# EAGLE design ESP32 (EAGLE 9.6.2)
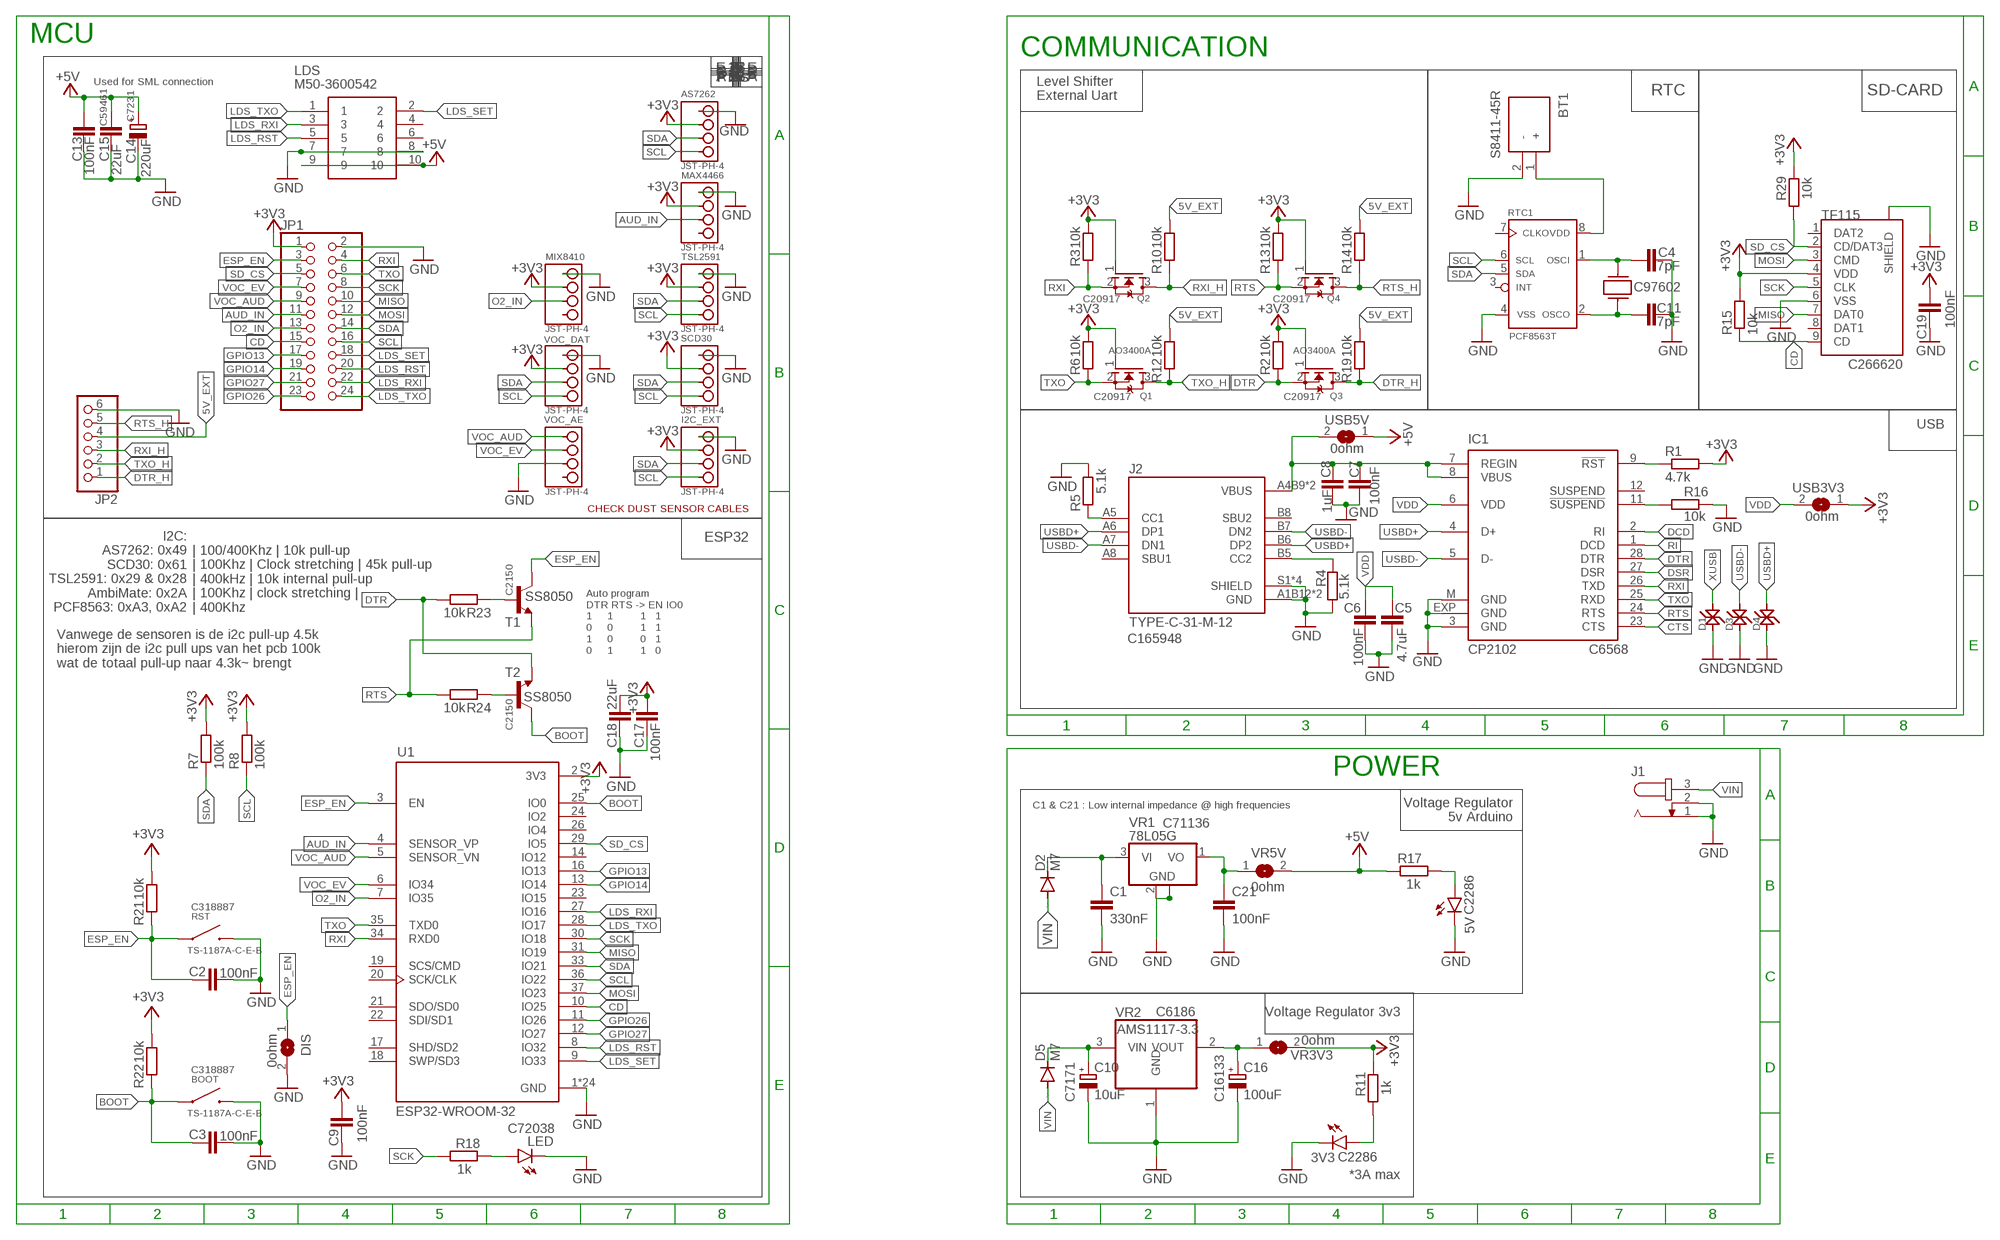
[diagram p0: schematic, sheet 1]

## Parts
3V3  C2286  LEDCHIPLED_0603  [CHIPLED_0603]
5V  C2286  LEDCHIPLED_0603  [CHIPLED_0603]
AS7262  JST-PH-4  [JST-PH-4]
BOOT  TS-1187A-C-E-B  [TS-1187A-C-E-B]
BT1  S8411-45R  [S8411-45R_1]
C1  330nF  C-EUC0805  [C0805]
C2  100nF  C-EUC0402  [C0402]
C3  100nF  C-EUC0402  [C0402]
C4  7pF  C-EUC0402  [C0402]
C5  4.7uF  C-EUC0402  [C0402]
C6  100nF  C-EUC0402  [C0402]
C7  100nF  C-EUC0402  [C0402]
C8  1uF  C-EUC0402  [C0402]
C9  100nF  C-EUC0402  [C0402]
C10  10uF  CPOL-EUA/3216-18R  [A/3216-18R]
C11  7pF  C-EUC0402  [C0402]
C13  100nF  C-EUC0402  [C0402]
C14  220uF  CPOL-EUD/7343-31R  [D/7343-31R]
C15  22uF  C-EUC0603  [C0603]
C16  100uF  CPOL-EUB/3528-21W  [B/3528-21W]
C17  100nF  C-EUC0402  [C0402]
C18  22uF  C-EUC0603  [C0603]
C19  100nF  C-EUC0402  [C0402]
C21  100nF  C-EUC0402  [C0402]
D1  LESD5D5.0CT1G  [LESD5D5.0CT1G]
D2  M7  M7DO-214AC  [DO-214AC]
D3  LESD5D5.0CT1G  [LESD5D5.0CT1G]
D4  LESD5D5.0CT1G  [LESD5D5.0CT1G]
D5  M7  M7DO-214AC  [DO-214AC]
DIS  0ohm  SJ  [SJ]
G1  32.768KHZ  [32.768KHZ]
I2C_EXT  JST-PH-4  [JST-PH-4]
IC1  CP2102  [MLP28]
J1  JACK-PLUG1  [SPC4078]
J2  TYPE-C-31-M-12  [HRO_TYPE-C-31-M-12]
JP1  PINHD-2X12  [2X12]
JP2  PINHD-1X6/90  [1X06/90]
LDS  M50-3600542  [M503600542]
LED  YELLOW  LEDCHIPLED_0603  [CHIPLED_0603]
MAX4466  JST-PH-4  [JST-PH-4]
MIX8410  JST-PH-4  [JST-PH-4]
Q1  AO3400A  MOSFET-NREFLOW  [SOT23]
Q2  AO3400A  MOSFET-NREFLOW  [SOT23]
Q3  AO3400A  MOSFET-NREFLOW  [SOT23]
Q4  AO3400A  MOSFET-NREFLOW  [SOT23]
R1  4.7k  R-EU_R0402  [R0402]
R2  10k  R-EU_R0402  [R0402]
R3  10k  R-EU_R0402  [R0402]
R4  5.1k  R-EU_R0402  [R0402]
R5  5.1k  R-EU_R0402  [R0402]
R6  10k  R-EU_R0402  [R0402]
R7  100k  R-EU_R0402  [R0402]
R8  100k  R-EU_R0402  [R0402]
R10  10k  R-EU_R0402  [R0402]
R11  1k  R-EU_R0805  [R0805]
R12  10k  R-EU_R0402  [R0402]
R13  10k  R-EU_R0402  [R0402]
R14  10k  R-EU_R0402  [R0402]
R15  10k  R-EU_R0402  [R0402]
R16  10k  R-EU_R0402  [R0402]
R17  1k  R-EU_R0805  [R0805]
R18  1k  R-EU_R0805  [R0805]
R19  10k  R-EU_R0402  [R0402]
R21  10k  R-EU_R0402  [R0402]
R22  10k  R-EU_R0402  [R0402]
R23  10k  R-EU_R0402  [R0402]
R24  10k  R-EU_R0402  [R0402]
R29  10k  R-EU_R0402  [R0402]
RST  TS-1187A-C-E-B  [TS-1187A-C-E-B]
RTC1  PCF8563T  [SOIC8]
SCD30  JST-PH-4  [JST-PH-4]
T1  SS8050  BC808-NPN-SOT23-BEC  [SOT23-BEC]
T2  SS8050  BC808-NPN-SOT23-BEC  [SOT23-BEC]
TF115  TF-115  [TF-115]
TSL2591  JST-PH-4  [JST-PH-4]
U1  ESP32-WROOM-32  [MODULE_ESP32-WROOM-32]
USB3V3  0ohm  SJ  [SJ]
USB5V  0ohm  SJ  [SJ]
VOC_AE  JST-PH-4  [JST-PH-4]
VOC_DAT  JST-PH-4  [JST-PH-4]
VR1  78L05G  78L05F  [SOT89]
VR2  AMS1117-3.3  REG1117  [SOT223]
VR3V3  0ohm  SJ  [SJ]
VR5V  0ohm  SJ  [SJ]

## Nets
5V_EXT: JP2.4 R10.1 R12.1 R14.1 R19.1
+3V3: AS7262.P2 C9.2 C17.2 C18.2 C19.2 I2C_EXT.P2 JP1.1 MAX4466.P2 MIX8410.P2 Q1.1(G) Q2.1(G) Q3.1(G) Q4.1(G) R1.2 R2.1 R3.1 R6.1 R7.2 R8.2 R11.2 R13.1 R15.2 R21.1 R22.1 R29.2 SCD30.P2 TF115.4(VDD) TSL2591.P2 U1.2(3V3) USB3V3.1 VOC_DAT.P2 VR3V3.2
+5V: C13.1 C14.+ C15.1 LDS.9 LDS.10 R17.2 USB5V.1 VR5V.2
AUD_IN: JP1.11 MAX4466.P3 U1.4(SENSOR_VP)
BOOT: BOOT.A BOOT.B(A) C3.1 R22.2 T2.C U1.25(IO0)
CD: JP1.15 R15.1 TF115.9(CD) U1.10(IO25)
CTS: IC1.23(CTS)
DCD: IC1.2(RI)
DSR: IC1.27(DSR)
DTR: IC1.28(DTR) Q3.2(S) R2.2 R23.1 T2.E
DTR_H: JP2.1 Q3.3(D) R19.2
ESP_EN: C2.1 DIS.1 JP1.3 R21.2 RST.A RST.B(A) T1.C U1.3(EN)
GND: 3V3.C 5V.C AS7262.P1 BOOT.C BOOT.D(C) BT1.2(-) C1.2 C2.2 C3.2 C4.2 C5.2 C6.2 C7.2 C8.2 C9.1 C10.- C11.2 C13.2 C14.- C15.2 C16.- C17.1 C18.1 C19.1 C21.2 D1.P$1 D3.P$1 D4.P$1 DIS.2 I2C_EXT.P1 IC1.3(GND) IC1.EXP(GND) IC1.M(GND) J1.1 J1.2 J2.A1B12(GND) J2.B1A12(GND) J2.S1(SHIELD) J2.S2(SHIELD) J2.S3(SHIELD) J2.S4(SHIELD) JP1.2 JP2.6 LDS.7 LDS.8 LED.C MAX4466.P1 MIX8410.P1 R4.2 R5.2 R16.1 RST.C RST.D(C) RTC1.4(VSS) SCD30.P1 TF115.6(VSS) TF115.10(SHIELD) TF115.11(SHIELD) TF115.12(SHIELD) TF115.13(SHIELD) TSL2591.P1 U1.1(GND) U1.15(GND) U1.38(GND) U1.39_1(GND) U1.39_2(GND) U1.39_3(GND) U1.39_4(GND) U1.39_5(GND) U1.39_6(GND) U1.39_7(GND) U1.39_8(GND) U1.39_9(GND) U1.39_10(GND) U1.39_11(GND) U1.39_12(GND) U1.39_13(GND) U1.39_14(GND) U1.39_15(GND) U1.39_16(GND) U1.39_17(GND) U1.39_18(GND) U1.39_19(GND) U1.39_20(GND) U1.39_21(GND) VOC_AE.P3 VOC_DAT.P1 VR1.2(GND) VR1.2@1(GND) VR2.1(GND)
GPIO13: JP1.17 U1.16(IO13)
GPIO14: JP1.19 U1.13(IO14)
GPIO26: JP1.23 U1.11(IO26)
GPIO27: JP1.21 U1.12(IO27)
LDS_RST: JP1.20 LDS.5 U1.8(IO32)
LDS_RXI: JP1.22 LDS.3 U1.27(IO16)
LDS_SET: JP1.18 LDS.2 U1.9(IO33)
LDS_TXO: JP1.24 LDS.1 U1.28(IO17)
MISO: JP1.10 TF115.7(DAT0) U1.31(IO19)
MOSI: JP1.12 TF115.3(CMD) U1.37(IO23)
N$1: C4.1 G1.2 RTC1.1(OSCI)
N$2: R23.2 T1.B
N$3: BT1.1(+) RTC1.8(VDD)
N$4: 3V3.A R11.1
N$5: IC1.9(!RST) R1.1
N$6: C11.1 G1.1 RTC1.2(OSCO)
N$7: C1.1 D2.C VR1.3(VI)
N$8: LED.A R18.2
N$9: R24.2 T2.B
N$10: J2.B5(CC2) R4.1
N$11: J2.A5(CC1) R5.1
N$12: IC1.11(!SUSPEND) R16.2
N$13: C21.1 VR1.1(VO) VR5V.1
N$14: C16.+ VR2.2(VOUT) VR3V3.1
N$15: 5V.A R17.1
N$19: C10.+ D5.C VR2.3(VIN)
O2_IN: JP1.13 MIX8410.P3 U1.7(IO35)
RI: IC1.1(DCD)
RTS: IC1.24(RTS) Q4.2(S) R13.2 R24.1 T1.E
RTS_H: JP2.5 Q4.3(D) R14.2
RXI: IC1.26(TXD) JP1.4 Q2.2(S) R3.2 U1.34(RXD0)
RXI_H: JP2.3 Q2.3(D) R10.2
SCK: JP1.8 R18.1 TF115.5(CLK) U1.30(IO18)
SCL: AS7262.P4 I2C_EXT.P4 JP1.16 R8.1 RTC1.6(SCL) SCD30.P4 TSL2591.P4 U1.36(IO22) VOC_DAT.P4
SD_CS: JP1.5 R29.1 TF115.2(CD/DAT3) U1.29(IO5)
SDA: AS7262.P3 I2C_EXT.P3 JP1.14 R7.1 RTC1.5(SDA) SCD30.P3 TSL2591.P3 U1.33(IO21) VOC_DAT.P3
TXO: IC1.25(RXD) JP1.6 Q1.2(S) R6.2 U1.35(TXD0)
TXO_H: JP2.2 Q1.3(D) R12.2
USBD+: D4.P$2 IC1.4(D+) J2.A6(DP1) J2.B6(DP2)
USBD-: D3.P$2 IC1.5(D-) J2.A7(DN1) J2.B7(DN2)
VDD: C5.1 C6.1 IC1.6(VDD) USB3V3.2
VIN: D2.A D5.A J1.3
VOC_AUD: JP1.9 U1.5(SENSOR_VN) VOC_AE.P1
VOC_EV: JP1.7 U1.6(IO34) VOC_AE.P2
XUSB: C7.1 C8.1 D1.P$2 IC1.7(REGIN) IC1.8(VBUS) J2.A4B9(VBUS) J2.B4A9(VBUS) USB5V.2
Unconnected: IC1.12(SUSPEND) J2.A8(SBU1) J2.B8(SBU2) LDS.4 LDS.6 MAX4466.P4 MIX8410.P4 RTC1.3(/INT) RTC1.7(CLKO) TF115.1(DAT2) TF115.8(DAT1) U1.14(IO12) U1.17(SHD/SD2) U1.18(SWP/SD3) U1.19(SCS/CMD) U1.20(SCK/CLK) U1.21(SDO/SD0) U1.22(SDI/SD1) U1.23(IO15) U1.24(IO2) U1.26(IO4) VOC_AE.P4

## Notes on the sheet
- MCU
- COMMUNICATION
- Pins
- Used for SML connection | RTC | SD-CARD
- Level Shifter
  External Uart
- USB
- CHECK DUST SENSOR CABLES
- ESP32
- I2C:
  AS7262: 0x49
  SCD30: 0x61
  TSL2591: 0x29 & 0x28
  AmbiMate: 0x2A
  PCF8563: 0xA3, 0xA2
- | 100/400Khz | 10k pull-up
  | 100Khz | Clock stretching | 45k pull-up
  | 400kHz | 10k internal pull-up
  | 100Khz | clock stretching | 
  | 400Khz
- Auto program
  DTR RTS -> EN IO0
  1     1         1   1
  0     0         1   1
  1     0         0   1
  0     1         1   0
- Vanwege de sensoren is de i2c pull-up 4.5k
  hierom zijn de i2c pull ups van het pcb 100k
  wat de totaal pull-up naar 4.3k~ brengt
- POWER
- Voltage Regulator
  5v Arduino
- C1 & C21 : Low internal impedance @ high frequencies
- Voltage Regulator 3v3
- *3A max

## Library data of the parts
3V3 5V = led:LED: LED OSRAM: - CHIPLED LG R971, LG N971, LY N971, LG Q971, LY Q971, LO R971, LY R971 LH N974, LH R974 LS Q976, LO Q976, LY Q976 LO Q996 - Hyper CHIPLED LW Q18S LB Q993, LB Q99A, LB R99A - SideLED LS A670, LO A670, LY A670, LG A670, LP A670 LB A673, LV A673, LT A673, LW A673 LH A674 LY A675 LS A676, LA A676, LO A676, LY A676, LW A676 LS A679, LY A679, LG A679 - Hyper Micro SIDELED® LS Y876, LA Y876, LO Y876, LY Y876 LT Y87S - SmartLED LW L88C, LW L88S LB L89C, LB L89S, LG L890 LS L89K, LO L89K, LY L89K LS L896, LA L896, LO L896, LY L896 - TOPLED LS T670, LO T670, LY T670, LG T670, LP T670 LSG T670, LSP T670, LSY T670, LOP T670, LYG T670 LG T671, LOG T671, LSG T671 LB T673, LV T673, LT T673, LW T673 LH T674 LS T676, LA T676, LO T676, LY T676, LB T676, LH T676, LSB T676, LW T676 LB T67C, LV T67C, LT T67C, LS T67K, LO T67K, LY T67K, LW E67C LS E67B, LA E67B, LO E67B, LY E67B, LB E67C, LV E67C, LT E67C LW T67C LS T679, LY T679, LG T679 LS T770, LO T770, LY T770, LG T770, LP T770 LB T773, LV T773, LT T773, LW T773 LH T774 LS E675, LA E675, LY E675, LS T675 LS T776, LA T776, LO T776, LY T776, LB T776 LHGB T686 LT T68C, LB T68C - Hyper Mini TOPLED® LB M676 - Mini TOPLED Santana® LG M470 LS M47K, LO M47K, LY M47K Source: http://www.osram.convergy.de LUXEON: - LUMILED® LXK2-PW12-R00, LXK2-PW12-S00, LXK2-PW14-U00, LXK2-PW14-V00 LXK2-PM12-R00, LXK2-PM12-S00, LXK2-PM14-U00 LXK2-PE12-Q00, LXK2-PE12-R00, LXK2-PE12-S00, LXK2-PE14-T00, LXK2-PE14-U00 LXK2-PB12-K00, LXK2-PB12-L00, LXK2-PB12-M00, LXK2-PB14-N00, LXK2-PB14-P00, LXK2-PB14-Q00 LXK2-PR12-L00, LXK2-PR12-M00, LXK2-PR14-Q00, LXK2-PR14-R00 LXK2-PD12-Q00, LXK2-PD12-R00, LXK2-PD12-S00 LXK2-PH12-R00, LXK2-PH12-S00 LXK2-PL12-P00, LXK2-PL12-Q00, LXK2-PL12-R00 Source: www.luxeon.com KINGBRIGHT: KA-3528ASYC Source: www.kingbright.com; PTNR: C2286
AS7262 I2C_EXT MAX4466 MIX8410 SCD30 TSL2591 VOC_AE VOC_DAT = Tilmann:JST-PH-4: 4 pin PH JST connector Partnr: C50137 Datasheet: Link <https://datasheet.lcsc.com/lcsc/2010211204_BOOMELE-Boom-Precision-Elec-C50137_C50137.pdf>; PTRNR: C50137
BOOT RST = Tilmann:TS-1187A-C-E-B: TS-1187A-C-E-B SMD Top actuated 50mA @ 12V Round button Partnr: C318887 Footprint: SMD-SW-4_5.1x5.1x2.5 Datasheet: Link <https://datasheet.lcsc.com/lcsc/2002271432_XKB-Connectivity-TS-1187A-C-E-B_C318887.pdf>; PRTNR: C318887
BT1 = S8411-45R:S8411-45R: HARWIN - S8411-45R - HOLDER, COIN CELL, CR1220, FULL REEL Source: Datasheet <https://cdn.harwin.com/pdfs/S8411R.pdf>; DESCRIPTION: HARWIN - S8411-45R - HOLDER, COIN CELL, CR1220, FULL REEL; HEIGHT: mm; MANUFACTURER_NAME: Harwin; MANUFACTURER_PART_NUMBER: S8411-45R; MOUSER_PART_NUMBER: 855-S8411-45R; MOUSER_PRICE-STOCK: https://www.mouser.co.uk/ProductDetail/Harwin/S8411-45R?qs=Qom7kyPojXY6B0JhnWxDgQ%3D%3D
C1-C9 C11 C13 C17-C19 C21 = rcl:C-EU: CAPACITOR, European symbol; SPICEPREFIX: C
C10 = rcl:CPOL-EU: POLARIZED CAPACITOR, European symbol; PTRNR: C7171; SPICEPREFIX: C
C14 = rcl:CPOL-EU: POLARIZED CAPACITOR, European symbol; PTRNR: C7231; SPICEPREFIX: C
C15 = rcl:C-EU: CAPACITOR, European symbol; PTRNR: C59461; SPICEPREFIX: C
C16 = rcl:CPOL-EU: POLARIZED CAPACITOR, European symbol; PTRNR: C16133; SPICEPREFIX: C
D1 D3 D4 = Tilmann:LESD5D5.0CT1G: LESD5D5.0CT1G Bidirectional ESD protection diode Partnr: C383211 Datasheet: link <https://datasheet.lcsc.com/lcsc/1912111437_LRC-LESD5D5.0CT1G_C383211.pdf>; PRTNR: C383211
D2 D5 = Tilmann:M7: DIODE M7 Diode Footprint: SMA Partnr: C95872 Datasheet: Link <https://datasheet.lcsc.com/lcsc/1810311713_MDD%EF%BC%88Microdiode-Electronics%EF%BC%89-M7_C95872.pdf>; PTNR: C95872
DIS USB3V3 USB5V VR3V3 VR5V = Tilmann:SJ: SMD solder JUMPER
G1 = Tilmann:32.768KHZ: SC-20S Crystal resonator Partnr: C97602 Freq: 32768Hz Datasheet: Link <https://datasheet.lcsc.com/lcsc/1811151451_Seiko-SC-20S,32.768kHz,20PPM,7pF_C97602.pdf> Note: needs two 4pf capacitors; PTRNR: C97602
IC1 = Tilmann:CP210*: Single-Chip USB to UART Bridge USB to UART converter Partnr: C6568 Datasheet: Link <https://datasheet.lcsc.com/lcsc/1811081920_SILICON-LABS-CP2102-GMR_C6568.pdf>; MF: FARNELL; MPN: CP2102-GM; OC_FARNELL: 9282130; OC_NEWARK: 30K5635; PTRNR: C6568
J1 = Tilmann:JACK-PLUG: DC POWER JACK Power Jack, DC, Right Angle, Through Hole, Rated 5A at 16VDC, PC Terminals Distributor: Farnell (www.Farnell.de) Drawing: 84N1161.pdf / 84N1162.pdf Manufacturer: SPC Technology (www.spctechnology.com) Type: SPC4077 / SPC 4078; OC_FARNELL: unknown; OC_NEWARK: unknown
J2 = Tilmann:TYPE-C-31-M-12: TYPE-C-31-M-12 SMD USB-C connector Partnr: C165948 Footprint: TYPE-C-31_L8.94-W7.3 Datasheet: Link <https://datasheet.lcsc.com/lcsc/1811131825_Korean-Hroparts-Elec-TYPE-C-31-M-12_C165948.pdf>; AVAILABILITY: No availability data; DESCRIPTION: USB Connectors 24 Receptacle 1 8.94*7.3mm RoHS; MF: HRO Electronics Co., Ltd.; MP: TYPE-C-31-M-12; PACKAGE: Package; PRICE: None; PTRNR: C165948
JP1 = pinhead:PINHD-2X12: PIN HEADER
JP2 = Tilmann:PINHD-1X6: PIN HEADER
LDS = M50-3600542:M50-3600542: Headers & Wire Housings 5+5 DIL PIN HDR SMT Au/Sn Source: Datasheet <https://www.mouser.it/datasheet/2/181/M50_360-1133637.pdf>; DESCRIPTION: Headers & Wire Housings 5+5 DIL PIN HDR SMT Au/Sn; HEIGHT: 5.13mm; MANUFACTURER_NAME: Harwin; MANUFACTURER_PART_NUMBER: M50-3600542; MOUSER_PART_NUMBER: 855-M50-3600542; MOUSER_PRICE-STOCK: https://www.mouser.co.uk/ProductDetail/Harwin/M50-3600542?qs=9fQaSFfsqsz29hu1Jz0tTA%3D%3D
LED = led:LED: LED OSRAM: - CHIPLED LG R971, LG N971, LY N971, LG Q971, LY Q971, LO R971, LY R971 LH N974, LH R974 LS Q976, LO Q976, LY Q976 LO Q996 - Hyper CHIPLED LW Q18S LB Q993, LB Q99A, LB R99A - SideLED LS A670, LO A670, LY A670, LG A670, LP A670 LB A673, LV A673, LT A673, LW A673 LH A674 LY A675 LS A676, LA A676, LO A676, LY A676, LW A676 LS A679, LY A679, LG A679 - Hyper Micro SIDELED® LS Y876, LA Y876, LO Y876, LY Y876 LT Y87S - SmartLED LW L88C, LW L88S LB L89C, LB L89S, LG L890 LS L89K, LO L89K, LY L89K LS L896, LA L896, LO L896, LY L896 - TOPLED LS T670, LO T670, LY T670, LG T670, LP T670 LSG T670, LSP T670, LSY T670, LOP T670, LYG T670 LG T671, LOG T671, LSG T671 LB T673, LV T673, LT T673, LW T673 LH T674 LS T676, LA T676, LO T676, LY T676, LB T676, LH T676, LSB T676, LW T676 LB T67C, LV T67C, LT T67C, LS T67K, LO T67K, LY T67K, LW E67C LS E67B, LA E67B, LO E67B, LY E67B, LB E67C, LV E67C, LT E67C LW T67C LS T679, LY T679, LG T679 LS T770, LO T770, LY T770, LG T770, LP T770 LB T773, LV T773, LT T773, LW T773 LH T774 LS E675, LA E675, LY E675, LS T675 LS T776, LA T776, LO T776, LY T776, LB T776 LHGB T686 LT T68C, LB T68C - Hyper Mini TOPLED® LB M676 - Mini TOPLED Santana® LG M470 LS M47K, LO M47K, LY M47K Source: http://www.osram.convergy.de LUXEON: - LUMILED® LXK2-PW12-R00, LXK2-PW12-S00, LXK2-PW14-U00, LXK2-PW14-V00 LXK2-PM12-R00, LXK2-PM12-S00, LXK2-PM14-U00 LXK2-PE12-Q00, LXK2-PE12-R00, LXK2-PE12-S00, LXK2-PE14-T00, LXK2-PE14-U00 LXK2-PB12-K00, LXK2-PB12-L00, LXK2-PB12-M00, LXK2-PB14-N00, LXK2-PB14-P00, LXK2-PB14-Q00 LXK2-PR12-L00, LXK2-PR12-M00, LXK2-PR14-Q00, LXK2-PR14-R00 LXK2-PD12-Q00, LXK2-PD12-R00, LXK2-PD12-S00 LXK2-PH12-R00, LXK2-PH12-S00 LXK2-PL12-P00, LXK2-PL12-Q00, LXK2-PL12-R00 Source: www.luxeon.com KINGBRIGHT: KA-3528ASYC Source: www.kingbright.com; PTRNR: C72038
Q1-Q4 = adafruit:MOSFET-N: N-Channel Mosfet 2N7002E - 60V 260mA SOT23 [Digikey: 2N7002ET1GOSTR-ND] - REEL BSH103 - 30V 850mA SOT23 [Digikey: 568-5013-1-ND]; PTRNR: C20917
R1-R8 R10-R19 R21-R24 R29 = rcl:R-EU_: RESISTOR, European symbol; SPICEPREFIX: R
RTC1 = Tilmann:PCF8563: PCF8563 SMD RTC Module I2C, YY-MM-DD-dd HH:MM:SS (24hr) Footprint: SOIC8 Partnr: C7440 Datasheet: Link <https://datasheet.lcsc.com/lcsc/1809141212_NXP-Semicon-PCF8563T-5,518_C7440.pdf>; PTNR: C7440
T1 T2 = transistor:*-NPN-: NPN Transistror BF959 corrected 2008.03.06; PTNR: C2150
TF115 = Tilmann:TF-115: TF-115 SMD SD card holder Footprint: TF-115 Partnr: C266620 Datasheet: Link <https://datasheet.lcsc.com/lcsc/2105061832_XUNPU-TF-115_C266620.pdf>; PTNR: C266620; PTRNR: C266620
U1 = ESP32-WROOM-32:ESP32-WROOM-32: Bluetooth, WiFi Transceiver Module 2.4GHz ~ 2.5GHz Surface Mount Check prices <https://pricing.snapeda.com/parts/ESP32-WROOM-32/Espressif%20Systems/view-part?ref=eda>; AVAILABILITY: In Stock; DESCRIPTION: Bluetooth, WiFi 802.11b/g/n, Bluetooth v4.2 +EDR, Class 1, 2 and 3 Transceiver Module 2.4GHz ~ 2.5GHz Antenna Not Included, U.FL Surface Mount; MF: Espressif Systems; MP: ESP32-WROOM-32; PACKAGE: Module Espressif Systems; PRICE: None; PURCHASE-URL: https://pricing.snapeda.com/search/part/ESP32-WROOM-32/?ref=eda
VR1 = linear:78L*: POSITOIV-VOLTAGE REGULATORS Output up to 100 mA Source: Datasheet <http://focus.ti.com/lit/ds/symlink/ua78l05.pdf>; PTRNR: C71136
VR2 = burr-brown:REG1117: 800mA and 1A Low Dropout (LDO) Positive Regulator 1.8V, 2.5V, 2.85V, 3.3V, 5V, and Adj; MPN: REG1117; OC_FARNELL: 1097566; OC_NEWARK: 14P6981; PTNR: C6186

## Board
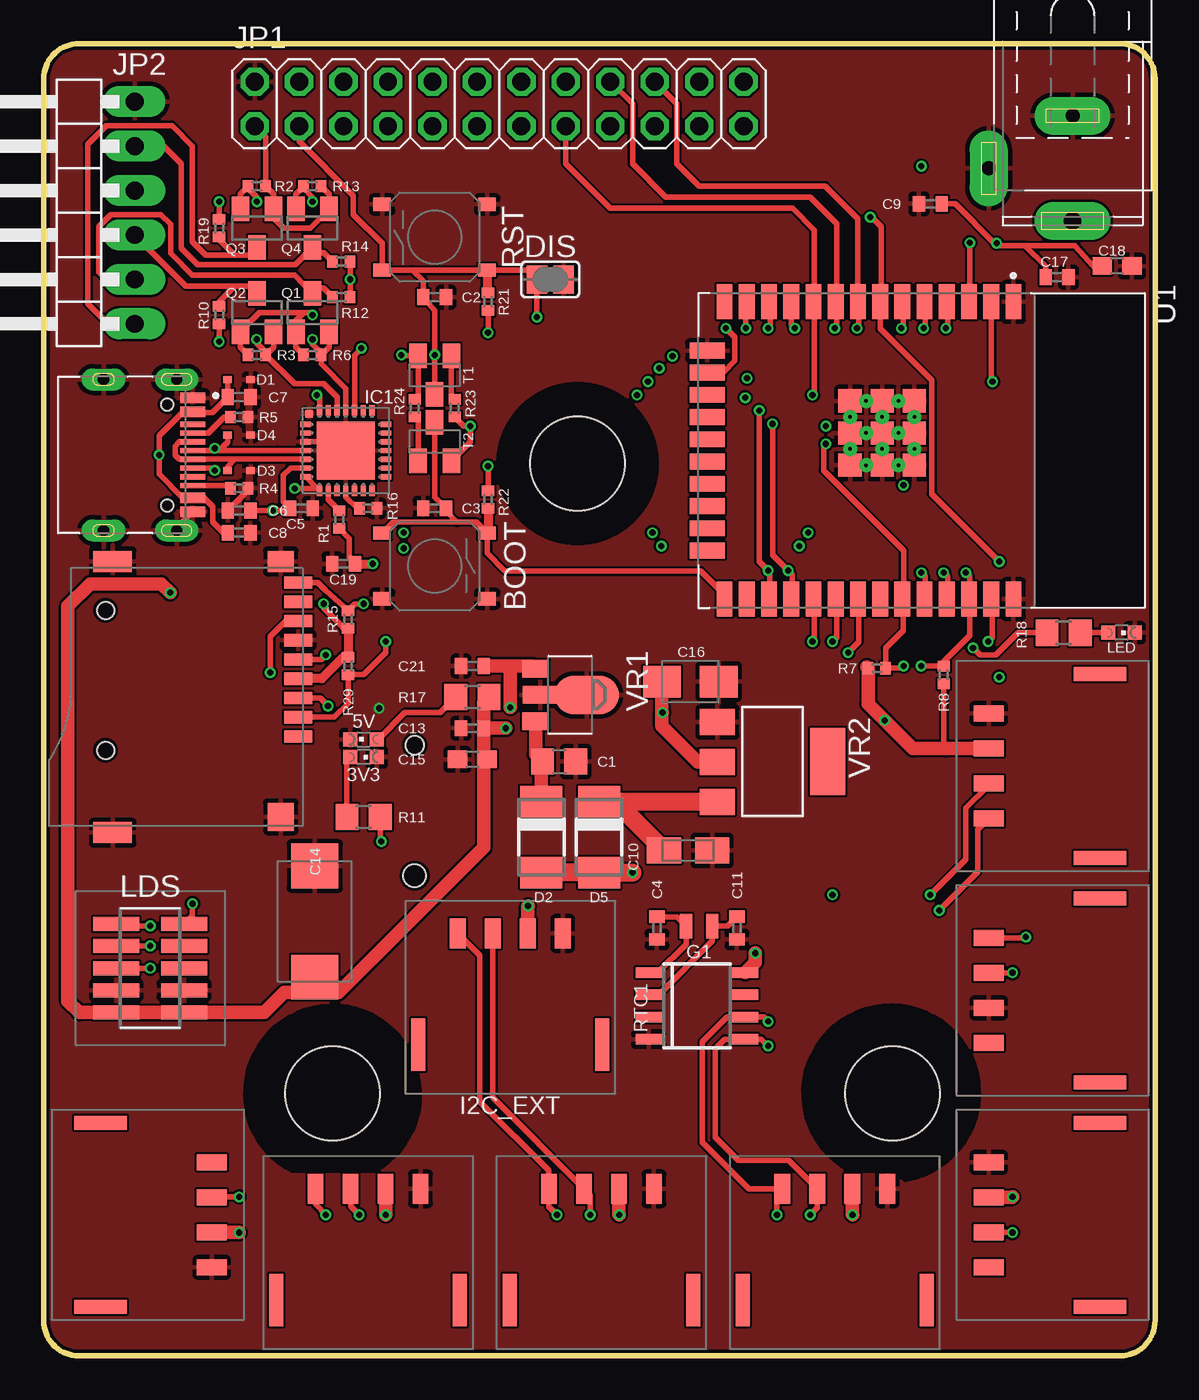
[diagram p1: board, top side]
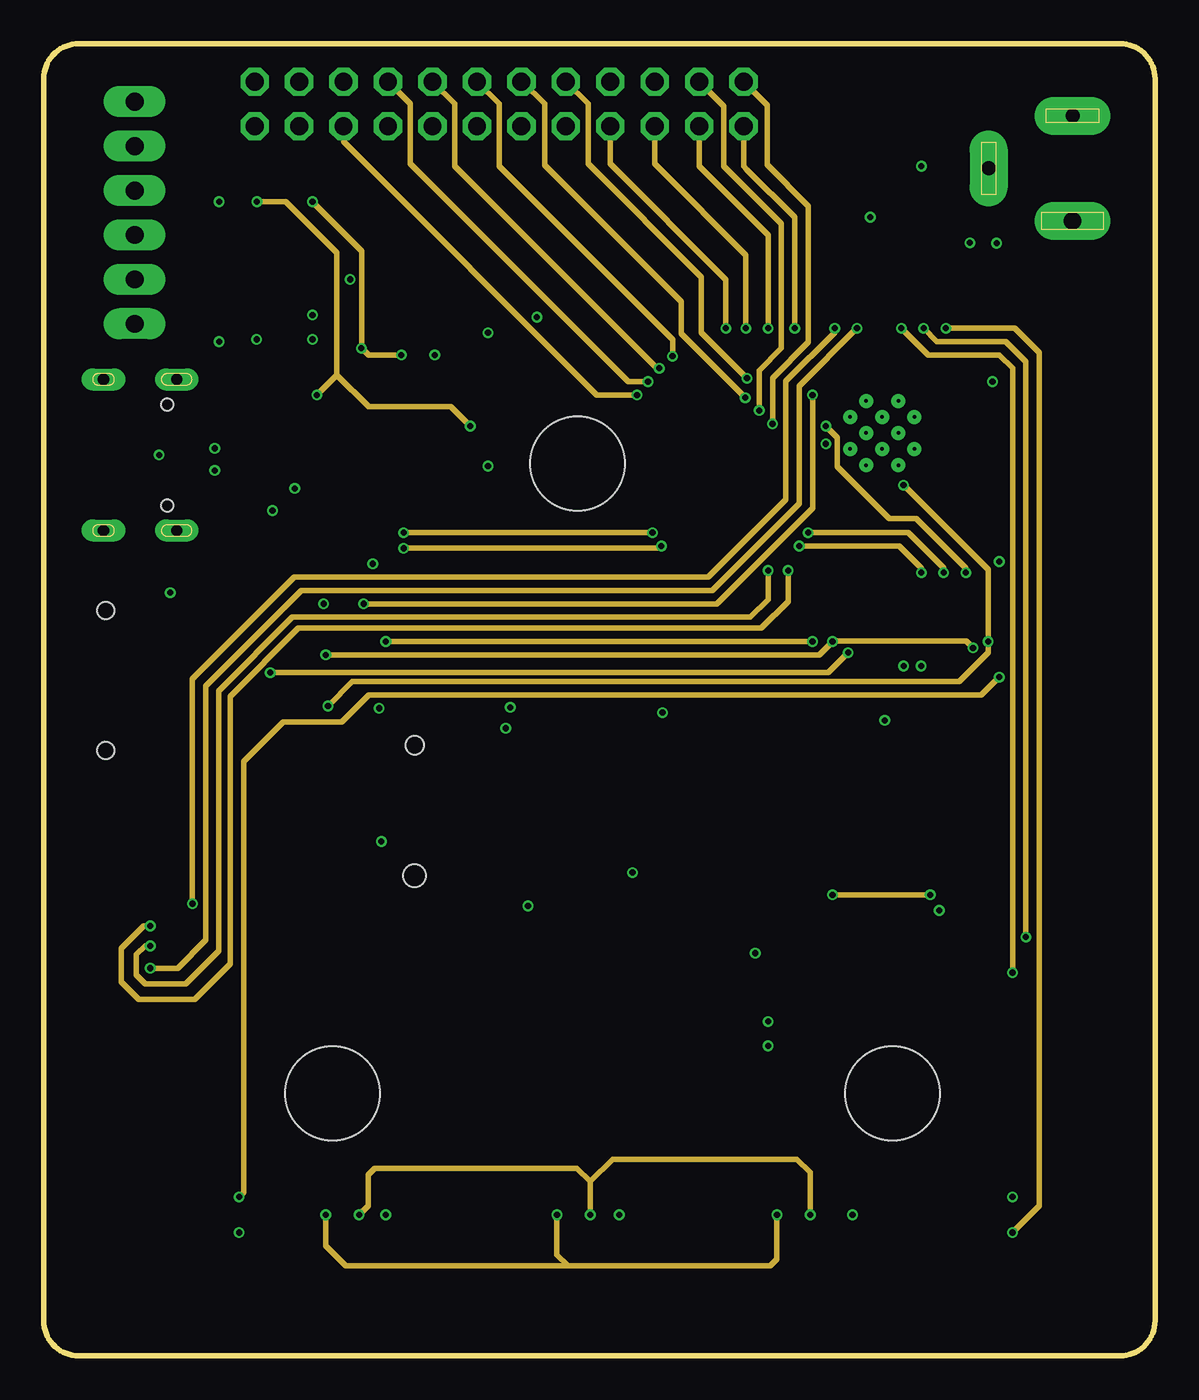
[diagram p2: board, inner layer Route2]
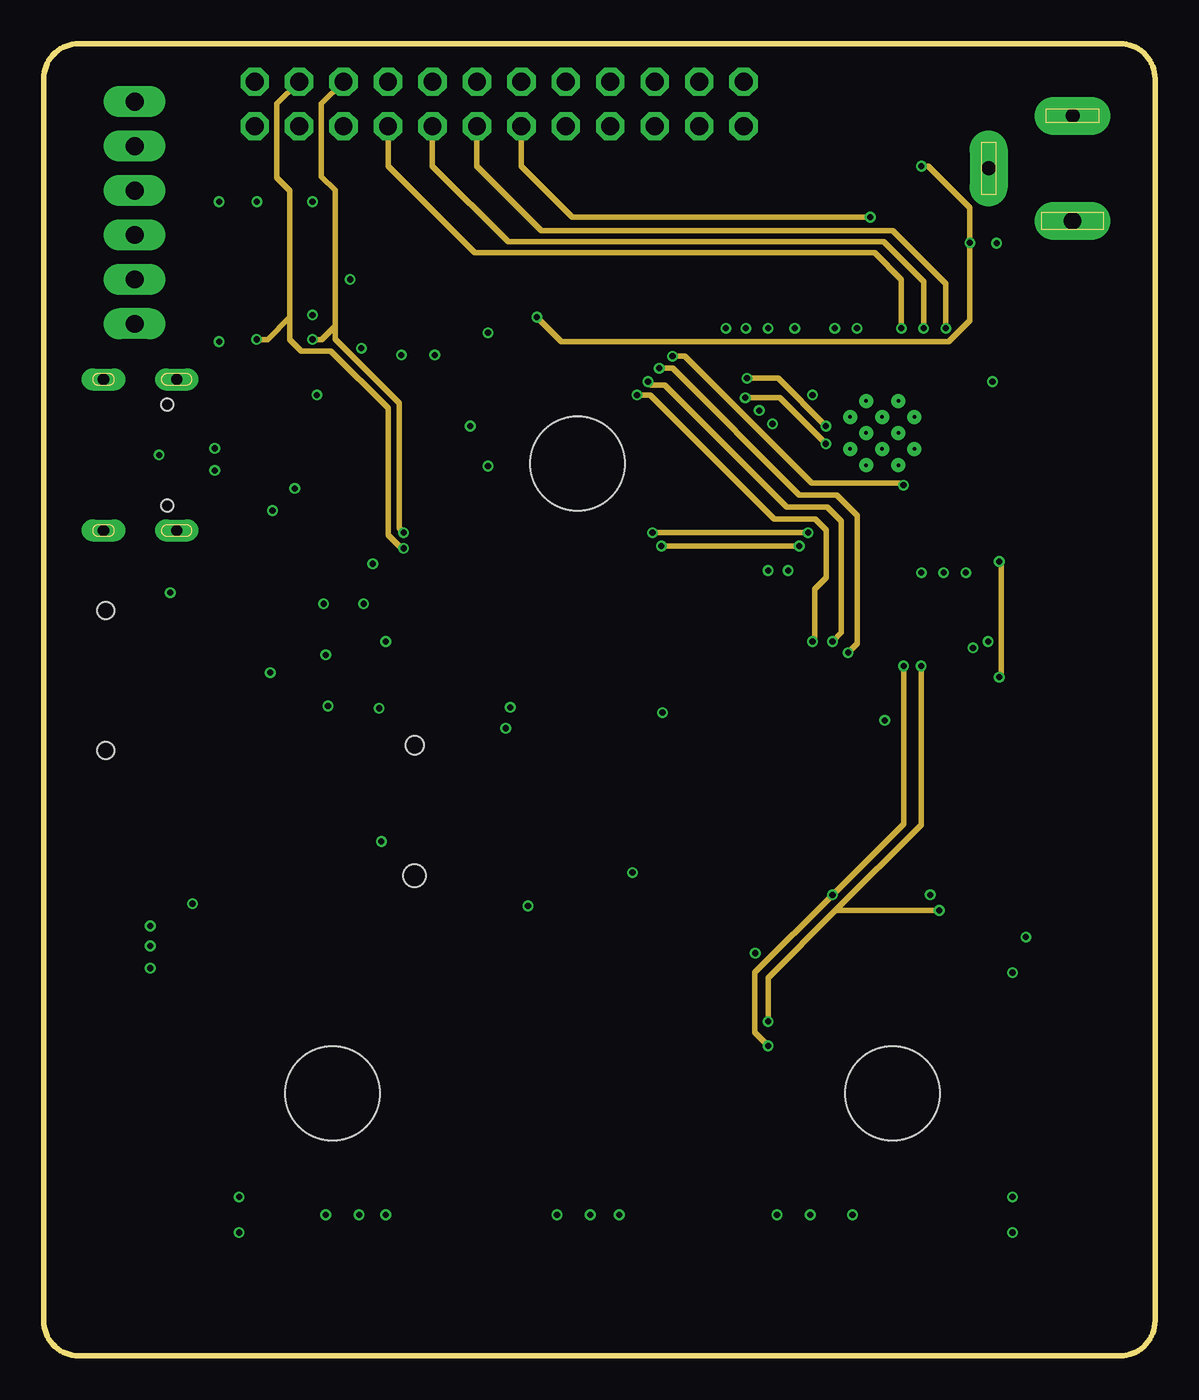
[diagram p3: board, inner layer Route15]
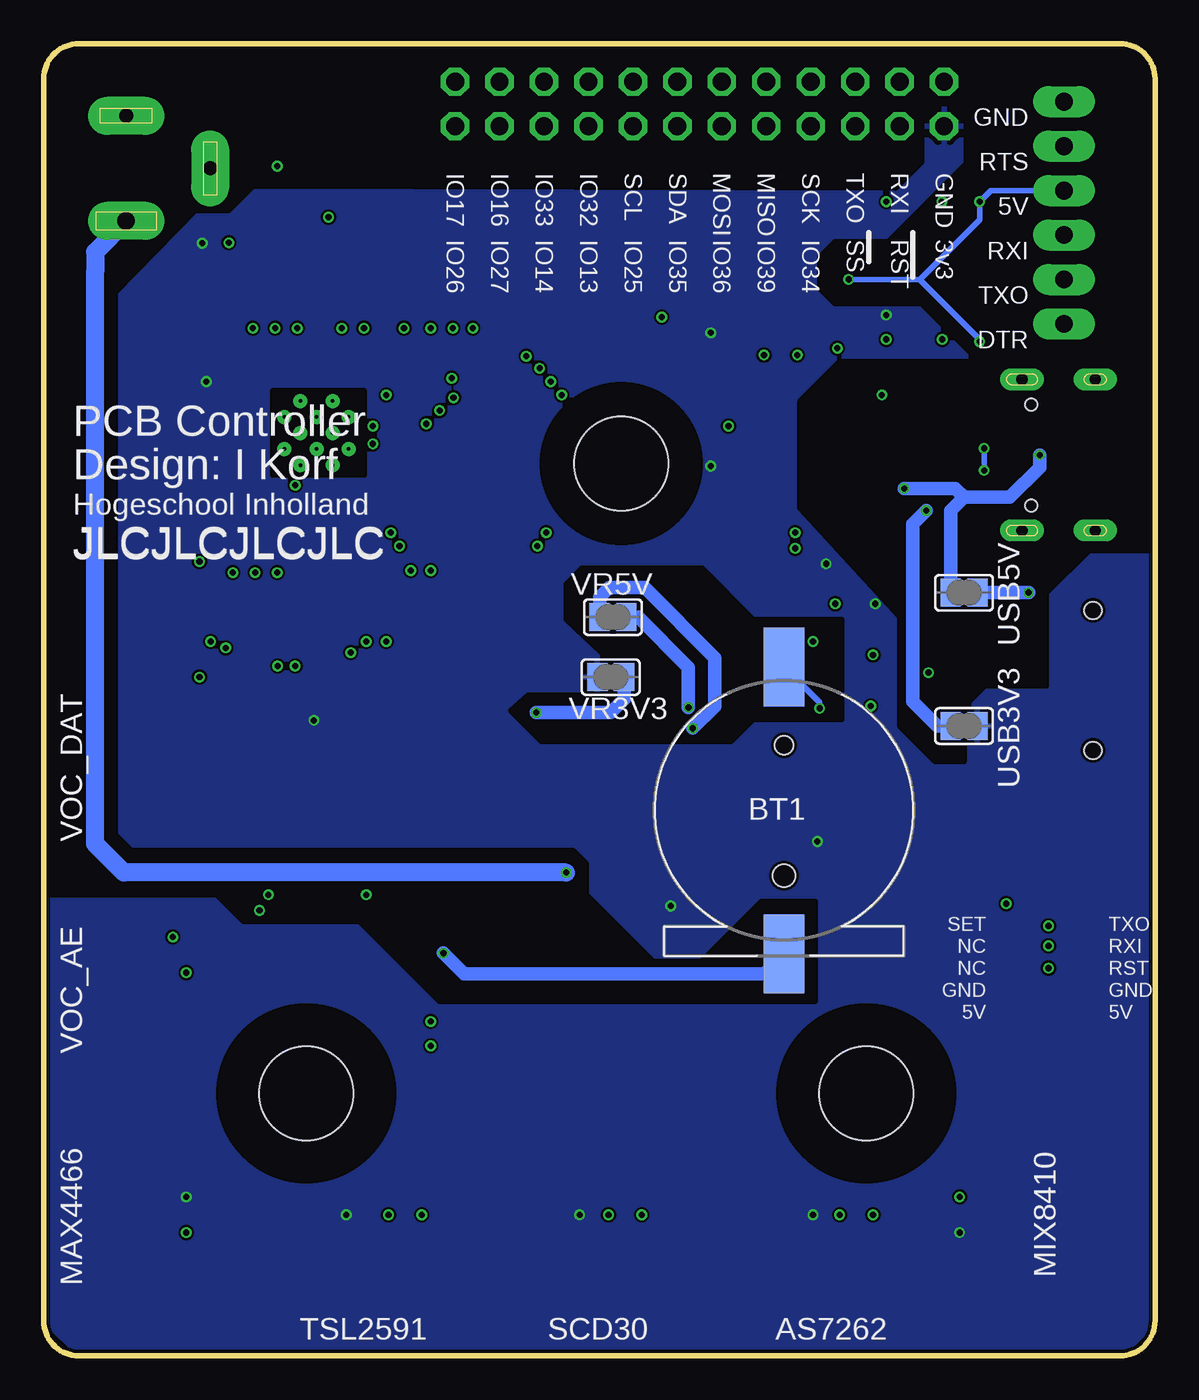
[diagram p4: board, bottom side, seen from below]

Size 63.5 x 75 mm. Coordinates in mm from the lower left corner, seen from the top.
Outline: 2,75 61.5,75 arc-90 63.5,73 63.5,2 arc-90 61.5,0 2,0 arc-90 0,2 0,73 arc-90 2,75
Copper layers (1+2*15+16): Top 0.035mm / dielectric 0.2mm / Route2 0.0175mm / dielectric 1.065mm / Route15 0.0175mm / dielectric 0.2mm / Bottom 0.035mm
Design rules "jlcpcb-4layers": minimum track width 5mil, minimum drill 0.2mm, track to track 5mil, track to pad 5mil, pad to pad 5mil, via to via 5mil, smd to smd 5mil, copper to edge 0.2mm, drill to drill 6mil, minimum pad ring 0.3mm, minimum via ring 0.13mm, stop-mask expansion 4mil, vias tented up to drill 0mil, thermal gap 10mil
Holes 5.4 mm at 16.5,15 48.5,15 30.5,51
tKeepout: 4 lines
tRestrict: area 26,46.5 to 35,55.5; 9 lines
bRestrict: area 11.5,10 to 21.5,20; area 43.5,10 to 53.5,20; area 26,46.5 to 35,55.5; 66 lines

### Footprints (pad centres in the part's own frame; a part is rotated, then mirrored left to right if it is on the bottom)
CHIPLED_0603 = smd 0.8 x 0.8: A 0,-0.75; C 0,0.75
JST-PH-4 = smd 0.9 x 1.7: P1 -3,-4.15; P2 -1,-4.15; P3 1,-4.15; P4 3,-4.15 | smd 0.8 x 3: SHIELD -5.25,2.2; SHIELD1 5.25,2.2
TS-1187A-C-E-B = smd 1 x 0.75: A -3,1.875; B 3,1.875; C -3,-1.875; D 3,-1.875
S8411-45R_1 = smd 2.3 x 4.5: 1 0,-8.2; 2 0,8.2 | hole 1.3: 0,-3.725 | hole 1.05: 0,3.725
C0805 = smd 1.3 x 1.5: 1 -0.95,0; 2 0.95,0
C0402 = smd 0.7 x 0.9: 1 -0.65,0; 2 0.65,0
A/3216-18R = smd 1.95 x 1.5: + 1.375,0; - -1.375,0
D/7343-31R = smd 2.55 x 2.7: + 3.175,0; - -3.175,0
C0603 = smd 1.1 x 1: 1 -0.85,0; 2 0.85,0
B/3528-21W = smd 2.15 x 1.8: + 1.625,0; - -1.625,0
LESD5D5.0CT1G = smd 0.48 x 0.4: P$1 -0.66,0; P$2 0.66,0
DO-214AC = smd 1.8 x 2.4: A 2.025,0; C -2.025,0
SJ = smd 1.168 x 1.6: 1 -0.762,0; 2 0.762,0
32.768KHZ = smd 0.7 x 1.4: 1 -0.75,0; 2 0.75,0
MLP28 = smd 0.6 x 0.3: 1 -2.3,1.5; 2 -2.3,1; 3 -2.3,0.5; 4 -2.3,0; 5 -2.3,-0.5; 6 -2.3,-1; 7 -2.3,-1.5; 15 2.3,-1.5; 16 2.3,-1; 17 2.3,-0.5; 18 2.3,0; 19 2.3,0.5; 20 2.3,1; 21 2.3,1.5 | smd 0.3 x 0.6: 8 -1.5,-2.3; 9 -1,-2.3; 10 -0.5,-2.3; 11 0,-2.3; 12 0.5,-2.3; 13 1,-2.3; 14 1.5,-2.3; 22 1.5,2.3; 23 1,2.3; 24 0.5,2.3; 25 0,2.3; 26 -0.5,2.3; 27 -1,2.3; 28 -1.5,2.3 | smd 3.3 x 3.3: EXP 0,0 | smd 0.435 x 0.435: M -2.103,2.103
SPC4078 = drill 0.8 pad 2.184 long: 1 -3,0; 2 0,-4.8 | drill 1 pad 2.184 long: 3 3,0
HRO_TYPE-C-31-M-12 = smd 0.6 x 1.45: A1B12 -3.25,5.095; A4B9 -2.45,5.095; B1A12 3.25,5.095; B4A9 2.45,5.095 | smd 0.3 x 1.45: A5 -1.25,5.095; A6 -0.25,5.095; A7 0.25,5.095; A8 1.25,5.095; B5 1.75,5.095; B6 0.75,5.095; B7 -0.75,5.095; B8 -1.75,5.095 | drill 0.65 pad 1.05 long: S1 -4.32,4.18; S2 4.32,4.18; S3 -4.32,0; S4 4.32,0 | hole 0.7: -2.89,3.65; 2.89,3.65
2X12 = drill 1.016 octagon: 1 -13.97,-1.27; 2 -13.97,1.27; 3 -11.43,-1.27; 4 -11.43,1.27; 5 -8.89,-1.27; 6 -8.89,1.27; 7 -6.35,-1.27; 8 -6.35,1.27; 9 -3.81,-1.27; 10 -3.81,1.27; 11 -1.27,-1.27; 12 -1.27,1.27; 13 1.27,-1.27; 14 1.27,1.27; 15 3.81,-1.27; 16 3.81,1.27; 17 6.35,-1.27; 18 6.35,1.27; 19 8.89,-1.27; 20 8.89,1.27; 21 11.43,-1.27; 22 11.43,1.27; 23 13.97,-1.27; 24 13.97,1.27
1X06/90 = drill 1.016 pad 1.778 long: 1 -6.35,-3.81; 2 -3.81,-3.81; 3 -1.27,-3.81; 4 1.27,-3.81; 5 3.81,-3.81; 6 6.35,-3.81
M503600542 = smd 0.8 x 2.62: 1 -2.54,-1.94; 2 -2.54,1.94; 3 -1.27,-1.94; 4 -1.27,1.94; 5 0,-1.94; 6 0,1.94; 7 1.27,-1.94; 8 1.27,1.94; 9 2.54,-1.94; 10 2.54,1.94
SOT23 = smd 1 x 1.4: 1 -0.95,-1.1; 2 0.95,-1.1; 3 0,1.1
R0402 = smd 0.6 x 0.7: 1 -0.5,0; 2 0.5,0
R0805 = smd 1.3 x 1.5: 1 -0.95,0; 2 0.95,0
SOIC8 = smd 0.6 x 1.5: 1 -1.905,-2.75; 2 -0.635,-2.75; 3 0.635,-2.75; 4 1.905,-2.75; 5 1.905,2.75; 6 0.635,2.75; 7 -0.635,2.75; 8 -1.905,2.75
SOT23-BEC = smd 1 x 1.4: B -0.95,-1.1; C 0,1.1; E 0.95,-1.1
TF-115 = smd 0.7 x 1.6: 1 -0.798,10.997; 2 -1.898,10.997; 3 -2.998,10.997; 4 -4.098,10.997; 5 -5.198,10.997; 6 -6.298,10.997; 7 -7.398,10.997; 8 -8.498,10.997; 9 -9.598,10.997 | smd 1.2 x 1.5: 10 -10.798,9.997 | smd 1.2 x 2.2: 11 -10.798,0.397; 12 4.702,0.397 | smd 1.6 x 1.5: 13 3.8,10 | hole 1: -7.998,-0.003; 0.002,-0.003
MODULE_ESP32-WROOM-32 = smd 2 x 0.9: 1 -8.5,5.26; 2 -8.5,3.99; 3 -8.5,2.72; 4 -8.5,1.45; 5 -8.5,0.18; 6 -8.5,-1.09; 7 -8.5,-2.36; 8 -8.5,-3.63; 9 -8.5,-4.9; 10 -8.5,-6.17; 11 -8.5,-7.44; 12 -8.5,-8.71; 13 -8.5,-9.98; 14 -8.5,-11.25; 25 8.5,-11.25; 26 8.5,-9.98; 27 8.5,-8.71; 28 8.5,-7.44; 29 8.5,-6.17; 30 8.5,-4.9; 31 8.5,-3.63; 32 8.5,-2.36; 33 8.5,-1.09; 34 8.5,0.18; 35 8.5,1.45; 36 8.5,2.72; 37 8.5,3.99; 38 8.5,5.26 | smd 0.9 x 2: 15 -5.715,-12.25; 16 -4.445,-12.25; 17 -3.175,-12.25; 18 -1.905,-12.25; 19 -0.635,-12.25; 20 0.635,-12.25; 21 1.905,-12.25; 22 3.175,-12.25; 23 4.445,-12.25; 24 5.715,-12.25 | smd 1.33 x 1.33: 39_1 -2.835,-0.405; 39_2 -1,-0.405; 39_3 0.835,-0.405; 39_4 -2.835,-2.24; 39_5 -1,-2.24; 39_6 0.835,-2.24; 39_7 -2.835,-4.075; 39_8 -1,-4.075; 39_9 0.835,-4.075 | drill 0.2 pad 0.3: 39_10 -1.917,-0.405; 39_11 -0.083,-0.405; 39_12 -2.835,-1.323; 39_13 -1,-1.323; 39_14 0.835,-1.323; 39_15 -1.917,-2.24; 39_16 -0.083,-2.24; 39_17 -2.835,-3.158; 39_18 -1,-3.158; 39_19 0.835,-3.158; 39_20 -1.917,-4.075; 39_21 -0.083,-4.075
SOT89 = smd 1 x 1.5: 1 -1.499,-1.981; 3 1.499,-1.981 | smd 1 x 2: 2 0,-1.727 | smd 2.2 x 3.7: 2@1 0,0.94
SOT223 = smd 1.499 x 2.007: 1 -2.261,-3.15; 2 0.025,-3.15; 3 2.311,-3.15 | smd 3.81 x 2.007: 4 0,3.15

### Placement (x,y rotation side)
3V3  18.28,34.22 270 top
5V  18.28,35.24 90 top
AS7262  18.53,5.39 180 top
BOOT  22.34,45.14 0 top
BT1  21.2,31.17 0 bottom
C1  29.45,33.97 0 top
C2  22.34,60.51 0 top
C3  22.34,48.45 180 top
C4  35.04,24.44 270 top
C5  14.72,48.45 0 top
C6  11.16,48.32 180 top
C7  11.16,54.8 0 top
C8  11.16,47.05 0 top
C9  50.66,65.84 0 top
C10  36.82,28.89 180 top
C11  39.61,24.44 270 top
C13  24.5,35.87 180 top
C14  15.48,24.82 270 top
C15  24.5,34.09 180 top
C16  36.95,38.54 180 top
C17  57.9,61.65 180 top
C18  61.33,62.29 180 top
C19  17.13,45.27 0 top
C21  24.5,39.43 180 top
D1  11.16,55.81 180 top
D2  28.44,29.65 270 top
D3  11.16,50.61 180 top
D4  11.16,52.64 180 top
D5  31.74,29.65 270 top
DIS  28.94,61.53 0 top
G1  37.45,24.57 180 top
I2C_EXT  26.66,20 180 top
IC1  17.26,51.75 0 top
J1  58.79,67.88 270 top
J2  3.42,51.49 270 top
JP1  26.02,71.56 0 top
JP2  1.39,65.34 90 top
LDS  6.08,22.16 270 top
LED  61.58,41.33 270 top
MAX4466  58.15,8.06 270 top
MIX8410  5.45,8.06 90 top
Q1  15.36,59.62 0 top
Q2  12.18,59.62 0 top
Q3  12.18,64.45 180 top
Q4  15.36,64.45 180 top
R1  16.88,47.81 270 top
R2  12.18,66.86 180 top
R3  12.18,57.21 0 top
R4  11.16,49.59 0 top
R5  11.16,53.65 0 top
R6  15.36,57.21 0 top
R7  47.61,39.3 180 top
R8  51.42,38.92 270 top
R10  10.02,59.5 90 top
R11  18.28,30.79 0 top
R12  17.01,60.51 180 top
R13  15.36,66.86 180 top
R14  17.01,62.54 180 top
R15  17.39,42.1 270 top
R16  18.53,48.45 180 top
R17  24.5,37.65 0 top
R18  58.28,41.33 0 top
R19  10.02,64.45 270 top
R21  25.39,60.26 90 top
R22  25.39,48.95 270 top
R23  23.48,54.16 90 top
R24  21.2,54.16 270 top
R29  17.39,39.43 90 top
RST  22.34,63.94 180 top
RTC1  37.33,20 270 top
SCD30  31.86,5.39 180 top
T1  22.34,56.07 180 top
T2  22.34,52.26 0 top
TF115  3.54,34.6 270 top
TSL2591  45.2,5.39 180 top
U1  50.15,51.75 270 top
USB3V3  10.91,36 180 bottom
USB5V  10.91,43.62 180 bottom
VOC_AE  58.15,20.89 270 top
VOC_DAT  58.15,33.71 270 top
VR1  30.09,37.78 270 top
VR2  41.64,33.97 270 top
VR3V3  31.1,38.79 180 bottom
VR5V  30.98,42.22 180 bottom

### Tracks (layer width: path | path; a pad name or v marks a point on that pad's centre or on a via)
5V_EXT  (via drill 0.35)
  Top 0.305: R14.1 v17.51,61.53 R12.1 | R19.1 v10.02,65.97 | v10.02,57.97 R10.1
  Bottom 0.305: 13.45,61.53 R19.1 v10.02,65.97 9.39,66.61 JP2.4 | v17.51,61.53 13.45,61.53 | v10.02,57.97 10.02,58.1 13.45,61.53
+3V3  (via drill 0.35)
  Top 0.305: 14.85,59.62 12.31,59.62 11.23,58.55 Q2.1 11.23,57.66 R3.1 | R13.1 16.3,66.41 Q4.1 16.3,65.53 15.23,64.45 13.7,64.45 13.13,65.02 Q3.1 13.13,66.41 R2.1 | R6.1 14.41,57.66 Q1.1 14.41,59.18 14.85,59.62 | C9.2 52.07,65.84 54.32,63.6 v54.45,63.6 54.57,63.47 56.07,63.47 | 56.07,63.47 57.25,62.29 C17.2 | 56.07,63.47 58.92,63.47 59.98,62.29 C18.2 | v15.36,59.5 15.23,59.62 14.85,59.62 | R2.1 12.68,68.65 | R21.1 v25.39,58.48 | R22.1 v25.39,50.86 | U1.2 54.14,55.76 v54.22,55.69 | R8.2 51.42,34.84 51.55,34.71 | C19.2 17.46,45.59 17.46,46.73 R1.2 | v19.29,29.4 19.23,29.46 R11.2 | v15.99,42.98 15.99,42.74 17.13,41.6 R15.2 | R2.1 12.68,69.66 JP1.1
  Top 0.508: C19.2 v18.8,45.27 | R15.2 R29.2 17.12,39.93 15.9,38.7 TF115.4
  Top 0.762: VOC_DAT.P2 51.55,34.71 49.67,34.71 v48.06,36.32 47.11,37.27 R7.2 47.04,39.38 | MIX8410.P2 9.61,7.04 v11.16,7.04 | AS7262.P2 19.53,8.08 v19.55,8.06 | SCD30.P2 32.87,8.08 v32.88,8.06 | TSL2591.P2 46.2,8.08 v46.22,8.06 | MAX4466.P2 55.34,9.06 v55.36,9.08 | 27.67,24.13 I2C_EXT.P2 27.66,25.7 v27.67,25.71
  pour Bottom: -0.01,72.96 2.02,74.99 61.71,74.99 63.49,73.21 63.49,2.09 61.33,-0.07 2.02,-0.07 -0.01,1.96
+5V  (via drill 0.35)
  Top 0.762: 14.63,20.76 16.86,20.76 25.15,29.05 25.15,34.3 | 14.63,20.76 13.74,20.76 12.6,19.62 LDS.10 LDS.9 2.02,19.62 1.39,20.25 1.39,42.86 2.66,44.13 6.72,44.13 v7.23,43.62 | C14.+ 15.52,21.65 14.63,20.76 | C13.1 v26.4,35.87 | C15.1 25.15,34.3 | 25.15,34.3 C13.1 | R17.2 25.15,37.35 C13.1
  Bottom 0.762: VR5V.2 31.74,43.37 31.19,43.91 29.16,43.91 25.15,39.9 25.15,37.13 v26.4,35.87 | v7.23,43.62 USB5V.1
AUD_IN  (via drill 0.35)
  Top 0.305: v51.55,58.73 51.65,58.84 51.65,60.2 U1.4 | MAX4466.P3 55.34,7.06 v55.36,7.04
  Route2 0.305: v55.36,7.04 56.88,8.57 56.88,57.34 55.49,58.73 v51.55,58.73
  Route15 0.305: v51.55,58.73 51.55,61.27 48.5,64.32 28.44,64.32 24.75,68 JP1.11
BOOT
  Top 0.305: 23.61,47.65 24.7,47.65 BOOT.B 25.34,45.88 26.36,44.86 37.53,44.86 38.9,43.49 U1.25 | 23.61,47.65 19.98,47.65 BOOT.A | 23.61,47.65 22.99,48.27 C3.1 22.36,49.08 22.36,51.24 22.36,51.49 22.36,53.34 T2.C
  Top 0.508: R22.2 25.39,47.07 BOOT.B
CD  (via drill 0.35)
  Top 0.305: v43.93,54.92 44.03,55.03 44.03,60.2 U1.10 44.03,60.3 44.03,64.34 42.79,65.59 32.37,65.59 29.83,68.13 JP1.15 | v18.28,42.98 17.78,42.98 R15.1 16.1,43.75 15.65,44.2 TF115.9
  Route2 0.305: v43.93,54.92 43.93,48.45 38.47,42.98 v18.28,42.98
DTR  (via drill 0.35)
  Top 0.305: v15.61,54.92 15.76,54.77 IC1.28 | Q3.2 11.23,66.41 R2.2 11.68,66.73 12.18,66.23 v12.18,65.97 | T2.E 24.37,52.24 v24.37,53.14 24,53.14 R23.1
  Route2 0.305: v12.18,65.97 13.83,65.97 16.75,63.05 16.75,56.07 | v24.37,53.14 23.25,54.27 18.53,54.27 18.53,54.29 16.75,56.07 | v15.61,54.92 16.75,56.07
DTR_H
  Top 0.305: Q3.3 11.76,62.92 10.91,62.92 | JP2.1 3.67,58.99 2.5,60.15 2.5,69.25 3.57,70.31 7.33,70.31 8.5,69.15 8.5,63.69 9.26,62.92 10.91,62.92 | R19.2 10.02,63.81 10.91,62.92
ESP_EN  (via drill 0.35)
  Top 0.305: 21.07,62.06 RST.B 19.34,63.59 17.69,65.24 17.69,66.33 14.59,69.42 JP1.3 | 21.07,62.06 RST.A 27.64,62.06 DIS.1 v28.18,59.37 | T1.C v22.34,57.21 22.34,59.73 C2.1 21.69,61.45 21.07,62.06 | v52.92,63.62 52.92,60.3 U1.3
  Top 0.508: RST.A 25.34,60.8 R21.2
  Route15 0.305: v28.18,59.37 29.58,57.97 51.72,57.97 52.92,59.17 v52.92,63.62 52.92,65.61 50.53,68 v50.15,68
GND  (via drill 0.35)
  Top 0.305: IC1.3 16.76,52.25 IC1.EXP | J2.S2 7.6,47.33 J2.B1A12 | R4.2 11.66,49.47 C6.2
  Bottom 0.305: BT1.2 19.16,37.34 v19.16,37.02
  pour Top: 0,75.08 63.5,75.08 63.5,-0.04 0,-0.04
GPIO13  (via drill 0.35)
  Top 0.305: v38.98,58.73 39.48,58.23 39.48,56.88 38.85,56.24 37.95,56.24 U1.16
  Route2 0.305: v38.98,58.73 38.98,61.53 32.37,68.13 JP1.17
GPIO14  (via drill 0.35)
  Top 0.305: v40.12,58.73 40.12,60.2 U1.13
  Route2 0.305: v40.12,58.73 40.12,62.92 35.17,67.88 34.91,68.13 JP1.19
GPIO26  (via drill 0.35)
  Top 0.305: U1.11 42.71,58.93 v42.91,58.73
  Route2 0.305: v42.91,58.73 42.91,65.08 40.18,67.81 39.99,68 JP1.23
GPIO27  (via drill 0.35)
  Top 0.305: v41.39,58.73 41.52,58.86 41.52,60.17 U1.12
  Route2 0.305: v41.39,58.73 41.39,64.07 37.45,68 JP1.21
LDS_RST  (via drill 0.35)
  Top 0.305: v46.47,58.73 46.57,58.84 46.57,60.2 U1.8 46.52,65.01 44.67,66.86 37.45,66.86 36.18,68.13 36.18,70.29 36.18,71.56 JP1.20 | v6.08,22.16 LDS.5
  Route2 0.305: v46.47,58.73 43.17,55.43 43.17,48.72 38.2,43.75 14.72,43.75 9.26,38.29 9.26,23.77 7.65,22.16 v6.08,22.16
LDS_RXI  (via drill 0.35)
  Top 0.305: v40.88,54.03 40.88,45.4 v41.39,44.89 41.49,44.79 41.49,43.3 U1.27 | v6.08,23.43 LDS.3
  Route2 0.305: v41.39,44.89 41.39,43.24 40.37,42.22 14.21,42.22 10,38.01 10,23.13 8.11,21.24 5.81,21.24 5.3,21.76 5.3,22.94 5.79,23.43 v6.08,23.43 | v40.88,54.03 40.88,56.32 42.15,57.59 42.15,64.7 38.85,68 38.85,70.29 38.85,71.43 JP1.22
LDS_SET  (via drill 0.35)
  Top 0.305: v45.2,58.73 45.3,58.84 45.3,60.2 U1.9 45.3,60.3 45.3,64.73 43.8,66.23 35.55,66.23 33.64,68.13 33.64,70.29 33.64,71.56 JP1.18 | v8.5,25.84 8.5,25.17 LDS.2
  Route2 0.305: v45.2,58.73 45.2,58.5 42.41,55.7 42.41,48.95 37.97,44.51 14.31,44.51 8.5,38.69 v8.5,25.84
LDS_TXO  (via drill 0.35)
  Top 0.305: v41.64,53.27 41.64,45.78 v42.53,44.89 42.76,44.66 42.76,43.3 U1.28 | v6.08,24.57 4.27,24.57 LDS.1
  Route2 0.305: v42.53,44.89 42.53,43.11 41.01,41.59 14.55,41.59 10.66,37.69 10.66,22.41 8.62,20.38 5.43,20.38 4.43,21.38 4.43,23.3 5.7,24.57 v6.08,24.57 | v41.64,53.27 41.64,55.9 43.7,57.95 43.7,65.72 41.33,68.08 41.33,70.29 41.33,71.49 JP1.24
MISO  (via drill 0.35)
  Top 0.305: v45.96,40.19 46.57,40.8 46.57,43.2 U1.31 | TF115.7 13.84,42 12.94,41.1 v12.94,39.05
  Route2 0.305: v45.96,40.19 44.82,39.05 v12.94,39.05 | v35.17,56.45 35.04,56.45 23.48,68 23.48,71.56 JP1.10
  Route15 0.305: v45.96,40.19 46.49,40.72 46.49,48.03 45.32,49.2 43.17,49.2 35.93,56.45 v35.17,56.45
MOSI  (via drill 0.35)
  Top 0.305: v53.96,40.83 54.19,41.06 54.19,43.2 U1.37 | v16.24,37.14 15.79,37.6 TF115.3
  Route2 0.305: v16.24,37.14 17.64,38.54 52.31,38.54 53.96,40.19 v53.96,40.83 53.96,44.93 v49.13,49.76 | v35.93,57.13 35.93,58.1 26.02,68 26.02,71.56 JP1.12
  Route15 0.305: v49.13,49.76 49,49.89 43.88,49.89 36.64,57.13 v35.93,57.13
N$1
  Top 0.305: C4.1 36.18,25.09 G1.2 36.7,23.52 35.08,21.9 RTC1.1
N$2
  Top 0.305: R23.2 23.29,54.85 T1.B
N$3  (via drill 0.35)
  Top 0.762: v40.66,23.02 40.66,22.49 RTC1.8
  Bottom 0.762: BT1.1 22.34,21.83 39.48,21.83 v40.66,23.02
N$4
  Top 0.305: 3V3.A 17.33,34.02 R11.1
N$5
  Top 0.305: R1.1 16.26,48.93 IC1.9
N$6
  Top 0.305: C11.1 39.09,24.57 G1.1 38.2,23.7 35.13,20.63 RTC1.2
N$7
  Top 0.762: VR1.3 28.11,34.36 C1.1 28.44,33.9 D2.C
N$8
  Top 0.305: LED.A R18.2
N$9
  Top 0.305: R24.2 21.39,53.47 T2.B
N$10
  Top 0.305: R4.1 10.38,49.74 J2.B5
N$11
  Top 0.305: J2.A5 9.4,52.74 10.31,53.65 R5.1
N$12
  Top 0.305: R16.2 17.9,48.45 17.26,49.09 IC1.11
N$13  (via drill 0.35)
  Top 0.762: VR1.1 27.95,39.43 26.66,39.43 | 26.66,39.43 C21.1 | v26.66,37.07 26.66,39.43
  Bottom 0.762: v26.66,37.07 26.66,39.35 29.53,42.22 VR5V.1
N$14  (via drill 0.35)
  Top 0.762: 35.32,36.8 v35.35,36.76 | 35.32,36.8 35.32,36 37.38,33.94 VR2.2 | C16.+ 35.32,36.8
  Bottom 0.762: VR3V3.1 30.32,38.77 30.32,37.56 31.11,36.76 v35.35,36.76
N$15
  Top 0.305: R17.1 22.66,36.76 20.63,36.76 19.1,35.24 5V.A
N$19
  Top 1.016: C10.+ 32.66,31.68 D5.C 31.76,31.66 VR2.3
O2_IN  (via drill 0.35)
  Top 0.305: v47.23,65.08 47.31,65.08 47.84,64.55 47.84,60.3 U1.7 47.79,58.7 50.73,55.76 50.73,49.26 v54.6,45.4 | v11.16,9.08 9.61,9.08 MIX8410.P3
  Route2 0.305: v54.6,38.79 53.58,37.78 18.57,37.78 17.02,36.23 13.68,36.23 11.42,33.97 11.42,9.33 v11.16,9.08
  Route15 0.305: v47.23,65.08 30.21,65.08 27.29,68 JP1.13 | v54.6,45.4 54.73,45.27 54.73,38.92 v54.6,38.79
RTS  (via drill 0.35)
  Top 0.305: v18.15,57.59 17.76,57.2 IC1.24 | Q4.2 14.41,66.41 R13.2 14.86,66.73 15.36,66.23 v15.36,65.97 | R24.1 21.39,54.85 T1.E 20.48,57.17 v20.44,57.21
  Route2 0.305: 18.17,57.61 18.17,63.16 v15.36,65.97 | v18.15,57.59 18.17,57.61 | 18.17,57.61 18.57,57.21 v20.44,57.21
RTS_H
  Top 0.305: R14.2 16,63.05 15.65,63.05 Q4.3 14.37,62.36 8.8,62.36 7.86,63.3 7.86,68.13 6.85,69.15 JP2.5
RXI  (via drill 0.35)
  Top 0.305: Q2.2 13.13,57.66 R3.2 | v50.15,44.76 50.38,44.53 50.38,43.3 U1.34 | R3.2 12.68,57.38 12.16,57.9 v12.16,58.1 | IC1.26 16.76,54.79 15.99,55.56 14.33,55.56 R3.2
  Route2 0.305: v50.15,44.76 50.15,45.02 48.88,46.29 v43.17,46.29 | v35.29,46.29 35.17,46.16 v20.56,46.16
  Route15 0.305: v43.17,46.29 v35.29,46.29 | v20.56,46.16 20.44,46.16 19.67,46.92 19.67,54.16 16.39,57.44 14.7,57.44 14.06,58.08 14.06,59.37 | v12.16,58.1 12.79,58.1 14.06,59.37 | 14.06,59.37 14.06,66.61 13.32,67.35 13.32,69.66 13.32,71.56 JP1.4
RXI_H
  Top 0.305: Q2.3 11.8,61.15 10.91,61.15 | 10.91,61.15 8.12,61.15 JP2.3 | R10.2 10.02,60.26 10.91,61.15
SCK  (via drill 0.35)
  Top 0.305: v45.07,40.83 45.3,41.06 45.3,43.2 U1.30 | R18.1 55.68,41.33 54.41,40.06 53.52,40.06 53.11,40.47 v53.1,40.47 | TF115.5 15.85,39.8 v16.12,40.06
  Route2 0.305: v16.12,40.06 44.31,40.06 v45.07,40.83 45.1,40.85 52.72,40.85 v53.1,40.47 | v34.53,55.69 33.39,55.69 20.94,68.13 20.94,71.56 JP1.8
  Route15 0.305: v45.07,40.83 45.58,41.33 45.58,47.7 44.76,48.52 42.46,48.52 35.48,55.49 34.72,55.49 v34.53,55.69
SCL  (via drill 0.35)
  Top 0.305: v41.9,8.06 41.9,9.24 TSL2591.P4 40.3,9.54 37.64,12.2 37.64,17.96 39.05,19.36 RTC1.6 41.14,19.36 v41.39,19.11 | v29.32,8.06 28.87,8.52 SCD30.P4 28.87,10.59 24.93,14.53 24.93,22.88 I2C_EXT.P4 | AS7262.P4 15.53,8.65 v16.12,8.06 | VOC_DAT.P4 53.37,30.08 53.37,27.66 v51.17,25.46 | v50.13,39.43 50.14,39.42 R8.1 51.42,39.67 52.92,41.17 52.92,43.2 U1.36 52.92,43.3 52.92,44.53 v52.69,44.76
  Route2 0.305: v41.9,8.06 41.9,5.52 41.52,5.14 29.96,5.14 | 29.96,5.14 29.32,5.77 v29.32,8.06 | 29.96,5.14 17.26,5.14 16.12,6.28 v16.12,8.06 | v52.69,44.76 52.69,45.02 49.85,47.86 48.32,47.86 45.35,50.84 45.35,52.49 v44.69,53.14 | v40.18,55.88 37.58,58.48 37.58,61.65 31.1,68.13 31.1,71.56 JP1.16
  Route15 0.305: 45.24,25.46 41.39,21.61 v41.39,19.11 | 45.24,25.46 50.13,30.35 v50.13,39.43 | v51.17,25.46 45.24,25.46 | v44.69,53.14 41.96,55.88 v40.18,55.88
SD_CS  (via drill 0.35)
  Top 0.305: v43.93,40.83 44.03,40.93 44.03,43.2 U1.29 | v19.55,40.83 19.55,40.19 18.28,38.93 R29.1 17.39,37.29 16.6,36.5 TF115.2
  Route2 0.305: v43.93,40.83 v19.55,40.83 | v33.9,54.92 31.61,54.92 17.13,69.4 JP1.5
  Route15 0.305: v43.93,40.83 44.06,40.95 44.06,43.83 44.72,44.49 44.72,47.19 44.08,47.83 41.75,47.83 34.66,54.92 v33.9,54.92
SDA  (via drill 0.35)
  Top 0.305: v43.8,8.06 44.2,8.46 TSL2591.P3 42.57,11.17 39.68,11.17 38.37,12.48 38.37,17.55 38.91,18.09 RTC1.5 41.01,18.09 v41.39,17.71 | v31.23,8.06 31.23,9.18 SCD30.P3 25.65,14.76 25.65,24.15 I2C_EXT.P3 | v18.02,8.06 17.53,8.55 AS7262.P3 | VOC_DAT.P3 54,32.61 52.69,31.3 52.69,28.38 v50.66,26.35 | v49.14,39.43 49.01,39.3 R7.1 48.11,40.45 49.11,41.45 49.11,43.2 U1.33 49.14,43.32 49.14,46.03 44.56,50.61 44.56,52 v44.69,52.13
  Route2 0.305: v50.66,26.35 v45.07,26.35 | v31.23,8.06 31.23,9.96 | v18.02,8.06 18.53,8.57 18.53,10.35 18.91,10.73 30.47,10.73 31.23,9.96 | v43.8,8.06 43.8,10.47 43.04,11.23 32.5,11.23 31.23,9.96 | v40.09,54.76 36.44,58.41 36.44,60.24 28.62,68.06 28.62,71.56 27.35,72.83 JP1.14
  Route15 0.305: v49.14,39.43 49.14,30.41 v45.07,26.35 40.63,21.9 40.63,18.47 v41.39,17.71 | v40.09,54.76 42.06,54.76 v44.69,52.13
TXO  (via drill 0.35)
  Top 0.305: Q1.2 16.3,57.66 R6.2 | v51.42,44.76 51.65,44.53 51.65,43.3 U1.35 | R6.2 15.86,57.34 15.36,57.84 v15.36,58.1 | R6.2 15.86,56.7 17.26,55.3 IC1.25
  Route2 0.305: v34.79,47.05 v20.56,47.05 | v51.42,44.76 51.42,45.02 49.39,47.05 v43.68,47.05
  Route15 0.305: v20.56,47.05 20.31,47.3 20.31,54.46 16.65,58.12 16.65,58.86 | 16.65,58.86 16.65,66.62 15.86,67.41 15.86,71.56 JP1.6 | v43.68,47.05 v34.79,47.05 | v15.36,58.1 15.89,58.1 16.65,58.86
TXO_H
  Top 0.305: R12.2 16,61.02 15.65,61.02 Q1.3 14.34,61.78 8.5,61.78 7.25,63.03 7.25,64.68 6.7,65.23 3.82,65.23 3.14,64.55 3.14,61.93 3.54,61.53 JP2.2
USBD+  (via drill 0.35)
  Top 0.305: J2.A6 9.51,51.74 9.64,51.87 v9.77,51.87 9.89,51.87 10.02,51.74 | 10.02,51.74 13.34,51.74 IC1.4 | J2.B6 9.63,50.74 v9.77,50.61 | D4.P$2 10.5,52.23 10.02,51.74
  Bottom 0.305: v9.77,50.61 v9.77,51.87
USBD-
  Top 0.305: J2.B7 7.74,52.24 7.51,52.01 7.51,51.48 7.74,51.24 J2.A7 10.91,51.25 | IC1.5 10.91,51.25 | D3.P$2 10.5,50.84 10.91,51.25
VDD  (via drill 0.35)
  Top 0.305: IC1.6 14.1,50.75 13.69,50.34 13.69,48.83 C5.1 13.94,48.32 v13.07,48.32 C6.1
  Bottom 0.762: v13.07,48.32 13.83,47.56 13.83,37.4 12.43,36 USB3V3.2
VIN  (via drill 0.35)
  Top 1.016: D2.A D5.A v33.64,27.62
  Bottom 1.016: v33.64,27.62 58.92,27.62 60.57,29.27 60.57,61.96 60.57,63.1 J1.3
VOC_AUD  (via drill 0.35)
  Top 0.305: v50.28,58.73 50.38,58.84 50.38,60.2 U1.5 | VOC_AE.P1 56.07,23.89 v56.12,23.94
  Route2 0.305: v50.28,58.73 51.04,57.97 54.98,57.97 56.12,56.83 v56.12,23.94
  Route15 0.305: v50.28,58.73 50.28,61.4 47.99,63.69 26.53,63.69 22.21,68 JP1.9
VOC_EV  (via drill 0.35)
  Top 0.305: v49.01,58.73 49.11,58.84 49.11,60.2 U1.6 | VOC_AE.P2 55.34,21.89 v55.36,21.9
  Route2 0.305: v49.01,58.73 50.53,57.21 54.6,57.21 55.36,56.45 v55.36,21.9
  Route15 0.305: v49.01,58.73 49.01,61.53 47.49,63.05 24.63,63.05 19.67,68 JP1.7
XUSB  (via drill 0.35)
  Top 0.305: IC1.7 15.61,49.59 | 15.61,49.59 IC1.8 | 15.61,49.59 15.6,49.58 v14.34,49.58 | C8.1 10.26,47.05 9.64,47.67 9.64,48.53 9.13,49.04 J2.B4A9 8.5,49.06 7.93,49.06 6.59,50.39 v6.59,51.49 6.59,52.59 7.93,53.93 8.5,53.93 J2.A4B9 8.55,53.91 9.63,53.91 C7.1 D1.P$2
  Bottom 0.762: USB5V.2 11.67,48.31 10.91,49.07 | v6.59,51.49 6.59,50.78 8.3,49.07 10.91,49.07 | v14.34,49.58 11.42,49.58 10.91,49.07

### Text on the board
bPlace: GND / RTS / 5V / RXI / TXO / DTR | PCB Controller / Design: I Korf | Hogeschool Inholland
bNames: GND / RXI / TXO / SCK / MISO / MOSI / SDA / SCL / IO32 / IO33 / IO16 / IO17 | 3v3 / RST / SS / IO34 / IO39 / IO36 / IO35 / IO25 / IO13 / IO14 / IO27 / IO26 | JLCJLCJLCJLC | JLCJLCJLCJLC | TXO / RXI / RST / GND / 5V | SET / NC / NC / GND / 5V
tDocu: BOM: / ESP32 / TYPE-C-31-M-12 / CP2102 / TF115 / PCF8563T / LM1085IS-3.3 / 78L05F / A03400A / SS8050 / TS-1187A-C-E-B | MCU / USB / UARTConv / SDCard / RTC / 3v3 Vreg / 5v Vreg / LVL_Shift MOSFETS / Transistors / Buttons